# Altium schematic sheet ServoBoard.SchDoc
size B
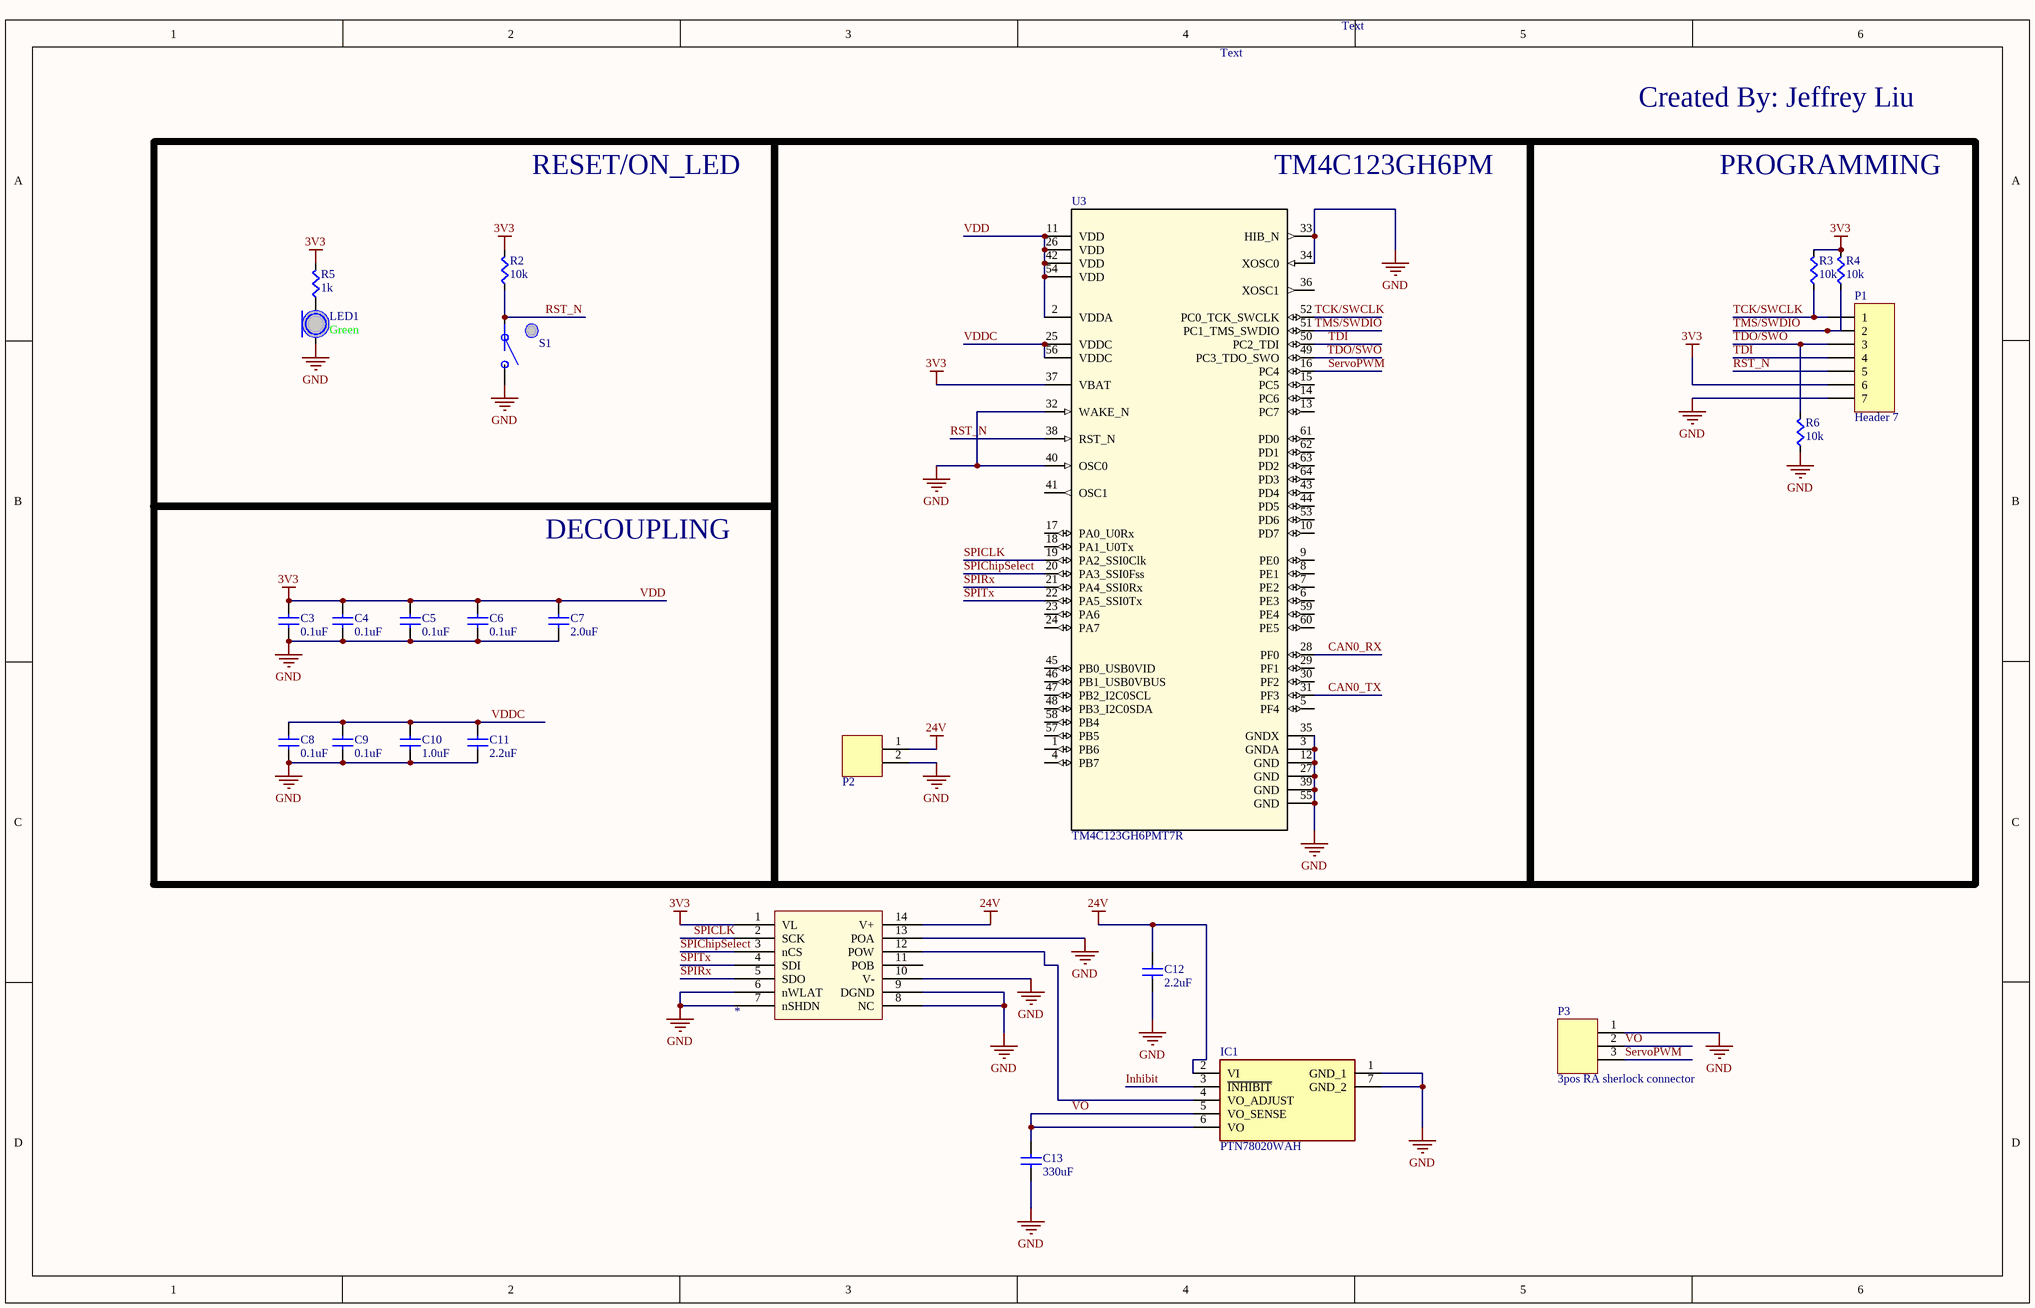
[diagram p0: ServoBoard.SchDoc]

## Parts
*  MCP41HV31  [MCP41HV31 - duplicate2]  (value not drawn)
C3  value 0.1uF  [CAPC0603]  (hidden comment: Cap)
C4  value 0.1uF  [CAPC0603]  (hidden comment: Cap)
C5  value 0.1uF  [CAPC0603]  (hidden comment: Cap)
C6  value 0.1uF  [CAPC0603]  (hidden comment: Cap)
C7  value 2.0uF  [CAPC0603]  (hidden comment: Cap)
C8  value 0.1uF  [CAPC0603]  (hidden comment: Cap)
C9  value 0.1uF  [CAPC0603]  (hidden comment: Cap)
C10  value 1.0uF  [CAPC0603]  (hidden comment: Cap)
C11  value 2.2uF  [CAPC0603]  (hidden comment: Cap)
C12  value 2.2uF  [CAPC1206]  (hidden comment: Cap)
C13  value 330uF  [CAPC0603]  (hidden comment: Cap)
IC1  PTN78020WAH  [EUL(R-PDSS-B7)]
LED1  Color: Green  [LED0603]  (hidden comment: LED)
P1  Header 7  [HDR1X7]
P2  2-pin Horz Sherlock  [MOLEX-HDR-1X2-SHERLOCK-HORZ]  (value not drawn)
P3  3pos RA sherlock connector  [MOLEX-HDR-1X3-SHERLOCK-RA]
R2  value 10k  [RES0603]  (hidden comment: Res)
R3  value 10k  [RES0603]  (hidden comment: Res)
R4  value 10k  [RES0603]  (hidden comment: Res)
R5  value 1k  [RES0603]  (hidden comment: Res)
R6  value 10k  [RES0603]  (hidden comment: Res)
S1  Button  [PTS645xxxxSMTR92]  (value not drawn)
U3  TM4C123GH6PMT7R  [TM4C123GH6PMT7R_L]

## Blocks framed on the sheet
RESET/ON_LED: LED1 R2 R5 S1
TM4C123GH6PM: P2 U3
PROGRAMMING: P1 R3 R4 R6
DECOUPLING: C3-C11

## Nets
24V: *.14(V+) C12.1(A) IC1.2(VI) P2.1
GND: *.6(nWLAT) *.7(nSHDN) *.8(NC) *.9(DGND) *.10(V-) *.13(POA) C3.2(B) C4.2(B) C5.2(B) C6.2(B) C7.2(B) C8.2(B) C9.2(B) C10.2(B) C11.2(B) C12.2(B) C13.2(B) IC1.1(GND_1) IC1.7(GND_2) LED1.C P1.7 P2.2 P3.1 R6.2(B) S1.B U3.3(GNDA) U3.12(GND) U3.27(GND) U3.32(WAKE_N) U3.33(HIB_N) U3.34(XOSC0) U3.35(GNDX) U3.39(GND) U3.40(OSC0) U3.55(GND)
VDD: *.1(VL) C3.1(A) C4.1(A) C5.1(A) C6.1(A) C7.1(A) P1.6 R2.1(A) R3.1(A) R4.1(A) R5.1(A) U3.2(VDDA) U3.11(VDD) U3.26(VDD) U3.37(VBAT) U3.42(VDD) U3.54(VDD)  [also labelled 3V3]
CAN0_RX: U3.28(PF0)
CAN0_TX: U3.31(PF3)
Inhibit: IC1.3(~{INHIBIT})
RST_N: P1.5 R2.2(B) S1.A U3.38(RST_N)
ServoPWM: P3.3 U3.16(PC4)
SPIChipSelect: *.3(nCS) U3.20(PA3_SSI0Fss)
SPICLK: *.2(SCK) U3.19(PA2_SSI0Clk)
SPIRx: *.5(SDO) U3.21(PA4_SSI0Rx)
SPITx: *.4(SDI) U3.22(PA5_SSI0Tx)
TCK/SWCLK: P1.1 R3.2(B) U3.52(PC0_TCK_SWCLK)
TDI: P1.4 U3.50(PC2_TDI)
TDO/SWO: P1.3 R6.1(A) U3.49(PC3_TDO_SWO)
TMS/SWDIO: P1.2 R4.2(B) U3.51(PC1_TMS_SWDIO)
VDDC: C8.1(A) C9.1(A) C10.1(A) C11.1(A) U3.25(VDDC) U3.56(VDDC)
VO: C13.1(A) IC1.5(VO_SENSE) IC1.6(VO) P3.2
Net*_12: *.12(POW) IC1.4(VO_ADJUST)
NetLED1_A: LED1.A R5.2(B)

Not connected (* = marked no-connect by the designer): * 11(POB); U3 1(PB6) 4(PB7) 5(PF4) 6(PE3) 7(PE2) 8(PE1) 9(PE0) 10(PD7) 13(PC7) 14(PC6) 15(PC5) 17(PA0_U0Rx) 18(PA1_U0Tx) 23(PA6) 24(PA7) 29(PF1) 30(PF2) 36(XOSC1) 41(OSC1) 43(PD4) 44(PD5) 45(PB0_USB0VID) 46(PB1_USB0VBUS) 47(PB2_I2C0SCL) 48(PB3_I2C0SDA) 53(PD6) 57(PB5) 58(PB4) 59(PE4) 60(PE5) 61(PD0) 62(PD1) 63(PD2) 64(PD3)

## Notes on the sheet
- Text
- Created By: Jeffrey Liu

## Library data of the parts
IC1 = PTN78020WAH: Integrated Circuit; Manufacturer_Name: Texas Instruments; Datasheet Link: http://www.ti.com/lit/gpn/ptn78020w; Manufacturer_Part_Number: PTN78020WAH; Mouser Part Number: 595-PTN78020WAH; Mouser Price/Stock: https://www.mouser.com/Search/Refine.aspx?Keyword=595-PTN78020WAH; RS Part Number: 5457849P; RS Price/Stock: http://uk.rs-online.com/web/p/products/5457849P
P1 = Header 7: Header, 7-Pin; LatestRevisionDate: 17-Jul-2002; LatestRevisionNote: Re-released for DXP Platform.; Publisher: Altium Limited
P2 = MOLEX-HDR-1x2-SHERLOCK_RA: Header, Molex, 2mm Pitch Sherlock Header, Single Row, Horizontal, 2 Circuits, Length 3.3mm,  0353630260; Manufacturer: Molex Inc; Manufacturer Part Number: 0353630260; Supplier Part Number 1: WM18931-ND; Supplier 1: Digi-Key
P3 = MOLEX-HDR-1x3-SHERLOCK_RA: Header, Molex, 2mm Pitch Sherlock Header, Single Row, Right Angle 3 Circuits, Length 3.3mm; Manufacturer Part Number: 35363-0360; Manufacturer: Molex Connector Corporation; Supplier Part Number 1: WM18932-ND; Supplier 1: Digi-Key
S1 = Button: SPST Button; Supplier 1: Digi-Key; Supplier Part Number 1: CKN9087CT-ND
U3 = TM4C123GH6PMT7R: Imported; PartNumber: TM4C123GH6PMTR; Manufacturer: Texas Instruments; CompType: IC; PIN_COUNT: 64; Application_BuildNumber: *; Alternate_PartNumber: TM4C123GH6PMT; PackageReference: PM0064A; MountType: SMT; RoHS: Y; RefDes: RefDes; TYPE: TYPE; Value: Value
C3-C13 = Cap: Supplier 1: Digi-Key; Supplier Part Number 1: 1276-1000-1-ND
LED1 = LED: Supplier 1: Digi-Key; Supplier Part Number 1: 754-1122-1-ND
R2-R6 = Res: Supplier 1: Digi-Key; Supplier Part Number 1: RMCF0603JT10K0CT-ND